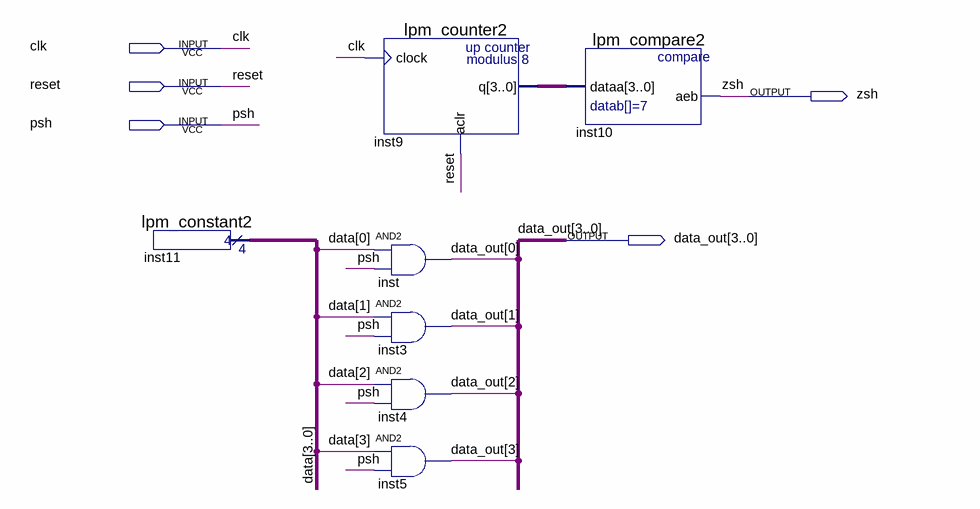
[diagram p0: schematic sheet]
// Quartus schematic master3.bdf as structural Verilog: 7 symbols, 5 pins
module master3 (
  input  clk,
  input  reset,
  input  psh,
  output zsh,
  output [3:0] data_out
);

  wire [3:0] data, inst9_q;

  lpm_constant2 inst11 (.result(data));
  lpm_counter2 inst9 (.clock(clk), .aclr(reset), .q(inst9_q));
  and inst (data_out[0], data[0], psh);
  and inst3 (data_out[1], data[1], psh);
  and inst4 (data_out[2], data[2], psh);
  and inst5 (data_out[3], data[3], psh);
  lpm_compare2 inst10 (.dataa(inst9_q), .aeb(zsh));
endmodule
